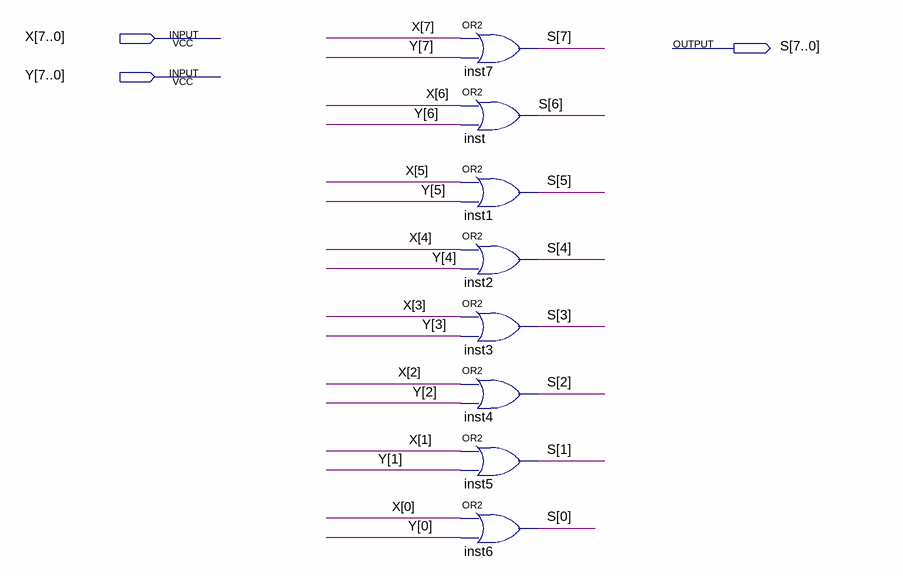
[diagram p0: schematic sheet]
// Quartus schematic or8bits.bdf as structural Verilog: 8 symbols, 3 pins
module or8bits (
  input  [7:0] X,
  input  [7:0] Y,
  output [7:0] S
);

  or inst7 (S[7], X[7], Y[7]);
  or inst (S[6], X[6], Y[6]);
  or inst1 (S[5], X[5], Y[5]);
  or inst2 (S[4], X[4], Y[4]);
  or inst3 (S[3], X[3], Y[3]);
  or inst4 (S[2], X[2], Y[2]);
  or inst5 (S[1], X[1], Y[1]);
  or inst6 (S[0], X[0], Y[0]);
endmodule
